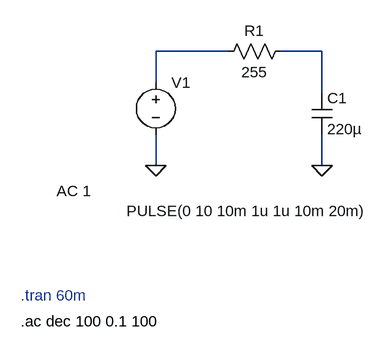
[diagram p0: schematic 2025-03-07_Current_Limiter.asc]
2025-03-07_Current_Limiter.asc, the LTspice schematic file:
Version 4.1
SHEET 1 880 680
WIRE 192 80 80 80
WIRE 336 80 272 80
WIRE 80 128 80 80
WIRE 336 144 336 80
WIRE 80 256 80 208
WIRE 336 256 336 208
FLAG 80 256 0
FLAG 336 256 0
SYMBOL voltage 80 112 R0
WINDOW 3 -45 214 Left 2
WINDOW 123 -153 183 Left 2
WINDOW 39 0 0 Left 0
SYMATTR Value PULSE(0 10 10m 1u 1u 10m 20m)
SYMATTR Value2 AC 1
SYMATTR InstName V1
SYMBOL res 288 64 R90
WINDOW 0 0 56 VBottom 2
WINDOW 3 32 56 VTop 2
SYMATTR InstName R1
SYMATTR Value 255
SYMBOL cap 320 144 R0
SYMATTR InstName C1
SYMATTR Value 220µ
TEXT -128 456 Left 2 ;.tran 60m
TEXT -128 496 Left 2 !.ac dec 100 0.1 100

The netlist it stands for:
* 2025-03-07_Current_Limiter.asc
V1 N001 0 PULSE(0 10 10m 1u 1u 10m 20m) AC 1
R1 N002 N001 255
C1 N002 0 220µ
* .tran 60m
.ac dec 100 0.1 100
.backanno
.end